# EAGLE design Controls PDB (EAGLE 8.6.0)
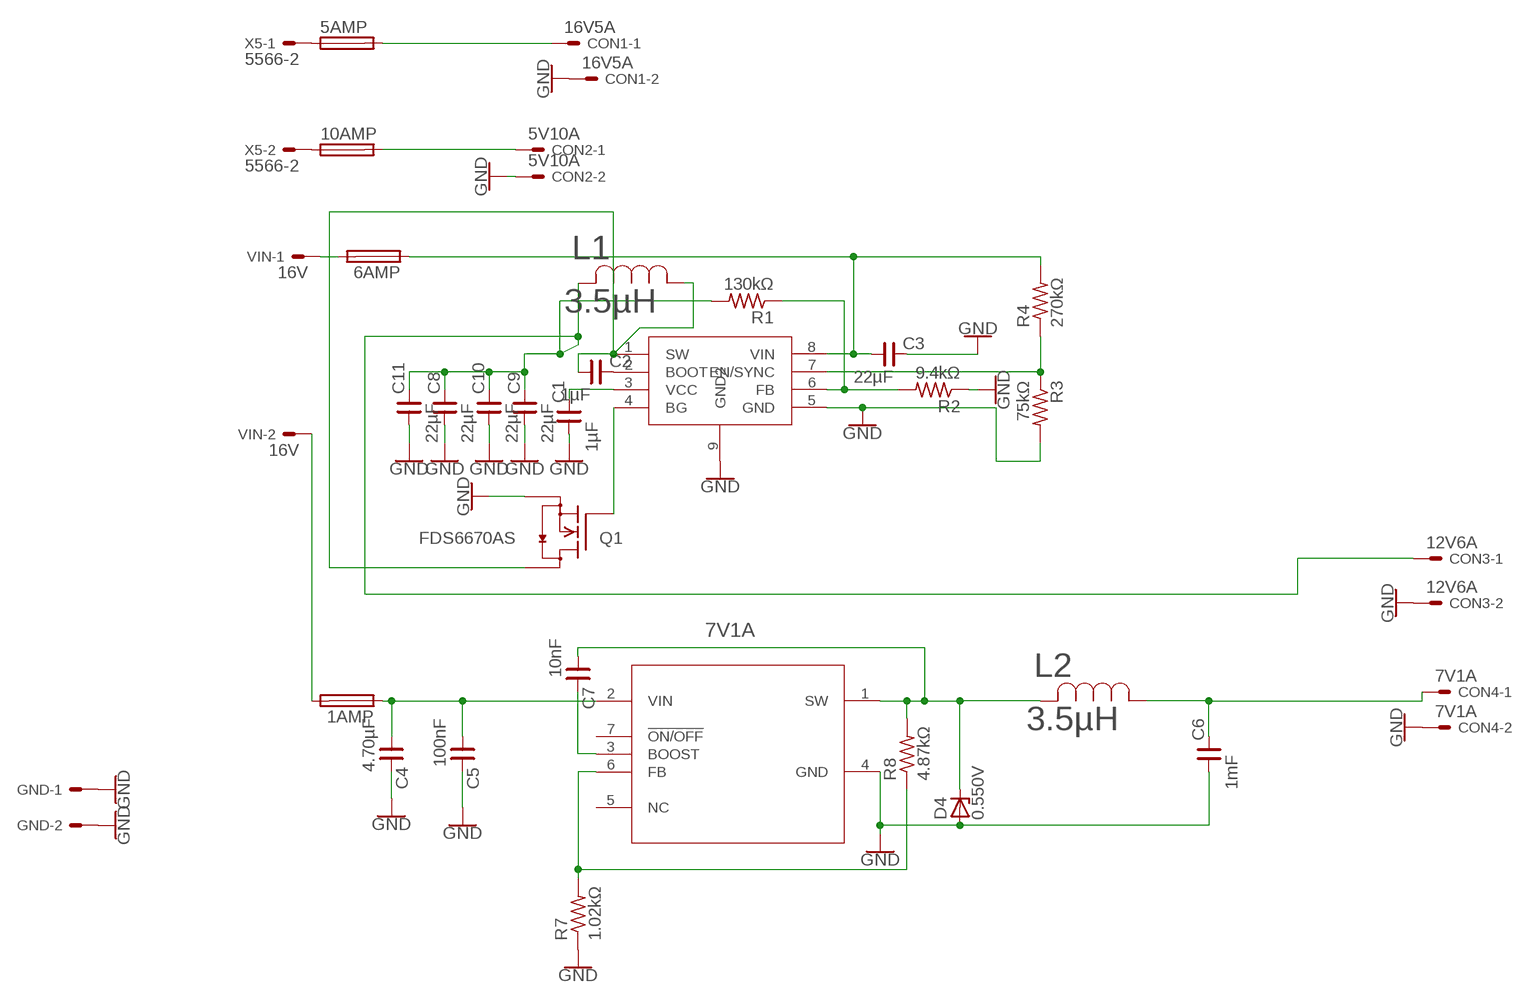
[diagram p0: schematic, sheet 1]

## Parts
1AMP  FUSEBLANK_5X20MM  [FUSE_HOLDER_5X20MM]
5AMP  FUSEBLANK_5X20MM  [FUSE_HOLDER_5X20MM]
6AMP  FUSEBLANK_5X20MM  [FUSE_HOLDER_5X20MM]
7V1A  LM2678T-3.3/NOPB  [TA07B]
10AMP  FUSEBLANK_5X20MM  [FUSE_HOLDER_5X20MM]
C1  1µF  CNP-1206  [1206]
C2  1µF  CNP-1206  [1206]
C3  22µF  CNP-1206  [1206]
C4  4.70µF  CNP-1206  [1206]
C5  100nF  CNP-1206  [1206]
C6  1mF  CNP-1206  [1206]
C7  10nF  CNP-1206  [1206]
C8  22µF  CNP-1206  [1206]
C9  22µF  CNP-1206  [1206]
C10  22µF  CNP-1206  [1206]
C11  22µF  CNP-1206  [1206]
CON1  16V5A  5566-2  [5566-2]
CON2  5V10A  5566-2  [5566-2]
CON3  12V6A  5566-2  [5566-2]
CON4  7V1A  5566-2  [5566-2]
D4  0.550V  SMF5.0A  [SOD123F]
GND  5566-2  [5566-2]
L1  3.5µH  SRR1260-3R5Y  [IND_BOURNS_SRR1260]
L2  3.5µH  SRR1260-3R5Y  [IND_BOURNS_SRR1260]
Q1  FDS6670AS  [SO-8]
R1  130kΩ  R-US_R1206  [R1206]
R2  9.4kΩ  R-US_R1206  [R1206]
R3  75kΩ  R-US_R1206  [R1206]
R4  270kΩ  R-US_R1206  [R1206]
R7  1.02kΩ  R-US_R1206  [R1206]
R8  4.87kΩ  R-US_R1206  [R1206]
U$1  SOIC  [SOIC127P599X175-9N]
VIN  16V  5566-2  [5566-2]
X5  5566-2  [5566-2]

## Nets
GND: 7V1A.4(GND) C1.P$1 C3.P$2 C4.P$2 C5.P$2 C6.P$1 C8.P$1 C9.P$1 C10.P$1 C11.P$1 CON1.2 CON2.2 CON3.2 CON4.2 D4.A GND.1 GND.2 Q1.3(S) R2.1 R3.2 R7.1 U$1.5(GND) U$1.9(GND2)
N$1: C2.P$2 U$1.2(BOOT)
N$4: C1.P$2 U$1.3(VCC)
N$5: R1.1 R2.2 U$1.6(FB)
N$6: 10AMP.2 CON2.1
N$7: 5AMP.2 CON1.1
N$8: 5AMP.1 X5.1
N$9: 10AMP.1 X5.2
N$10: 1AMP.2 VIN.2
N$11: 6AMP.1 C3.P$1 R4.2 U$1.8(VIN)
N$12: R3.1 R4.1 U$1.7(EN/SYNC)
N$13: C6.P$2 CON4.1 L2.1
N$14: 6AMP.2 VIN.1
N$15: Q1.4(G) U$1.4(BG)
N$16: 7V1A.1(SW) C7.P$1 D4.C L2.2 R8.2
N$17: 1AMP.1 7V1A.2(VIN) C4.P$1 C5.P$1
N$18: 7V1A.6(FB) R7.2 R8.1
N$19: 7V1A.3(BOOST) C7.P$2
N$20: C2.P$1 L1.1 Q1.8(D) U$1.1(SW)
N$21: C8.P$2 C9.P$2 C10.P$2 C11.P$2 CON3.1 L1.2 R1.2
Unconnected: 7V1A.5(NC) 7V1A.7(!ON/OFF) Q1.1(S) Q1.2(S) Q1.5(D) Q1.6(D) Q1.7(D)

## Library data of the parts
1AMP 5AMP 6AMP 10AMP = fuse:FUSE: Fuse; OC_FARNELL: unknown; OC_NEWARK: unknown
7V1A = lm2678thruHoleFunctional:LM2678T-3.3/NOPB; MANUFACTURER_PART_NUMBER: LM2678T3.3NOPB; VENDOR: Texas Instruments
C1-C11 = cap-master:CNP-: NON-POLARIZED CAP
CON1-CON4 GND VIN X5 = con-molex:5566-2: Mini FIT connector 2 pol Source: http://www.molex.com; OC_FARNELL: 1822072; OC_NEWARK: unknown
D4 = smf_11:SMF*A: SMF Series TVS Diodes Source: http://www.littelfuse.com/~/media/electronics/datasheets/tvs_diodes/littelfuse_tvs_diode_smf_datasheet.pdf.pdf; MF: Littelfuse; MPN: SMF5.0A; OC_FARNELL: unknown; OC_NEWARK: unknown
L1 L2 = inducteeer:SRR1260-3R5Y; MANUFACTURER_PART_NUMBER: SRR12603R5Y; VENDOR: Bourns Electronics
Q1 = FDS6670AS:FDS6670AS: Fairchild's FDS6670AS 30V N-Channel PowerTrench® SyncFET General Description: The FDS6670AS is designed to replace a single SO-8 MOSFET and Schottky diode in synchronous DC:DC power supplies. This 30V MOSFET is designed to maximize power conversion efficiency, providing a low RDS(ON) and low gate charge. The FDS6670AS includes an integrated Schottky diode using Fairchild's monolithic SyncFET technology. Applications: DC/DC converter Low side notebook Features: 13.5 A, 30 V. RDS(ON) max= 9.0 mOhm @ VGS = 10 V RDS(ON) max= 11.5 mOhm @ VGS = 4.5 V Includes SyncFET Schottky body diode Low gate charge (27nC typical) High performance trench technology for extremely low RDS(ON) and fast switching High power and current handling capability Please send any comments to: messi@users.sourceforge.net; AVAILABILITY: Good; DESCRIPTION: FDS6670AS Series N-Channel 30 V 9 mOhm PowerTrench Mosfet - SOIC-8; MF: ON; MP: FDS6670AS; PACKAGE: SOIC-8 Fairchild Semiconductor; PRICE: 0.47 USD
R1-R4 R7 R8 = resistor:R-US_: RESISTOR, American symbol
U$1 = SOIC127P599X175-9N:SOIC

## Net classes
0 top: width 1.016 mm
1 bottom: width 1.016 mm

## Board
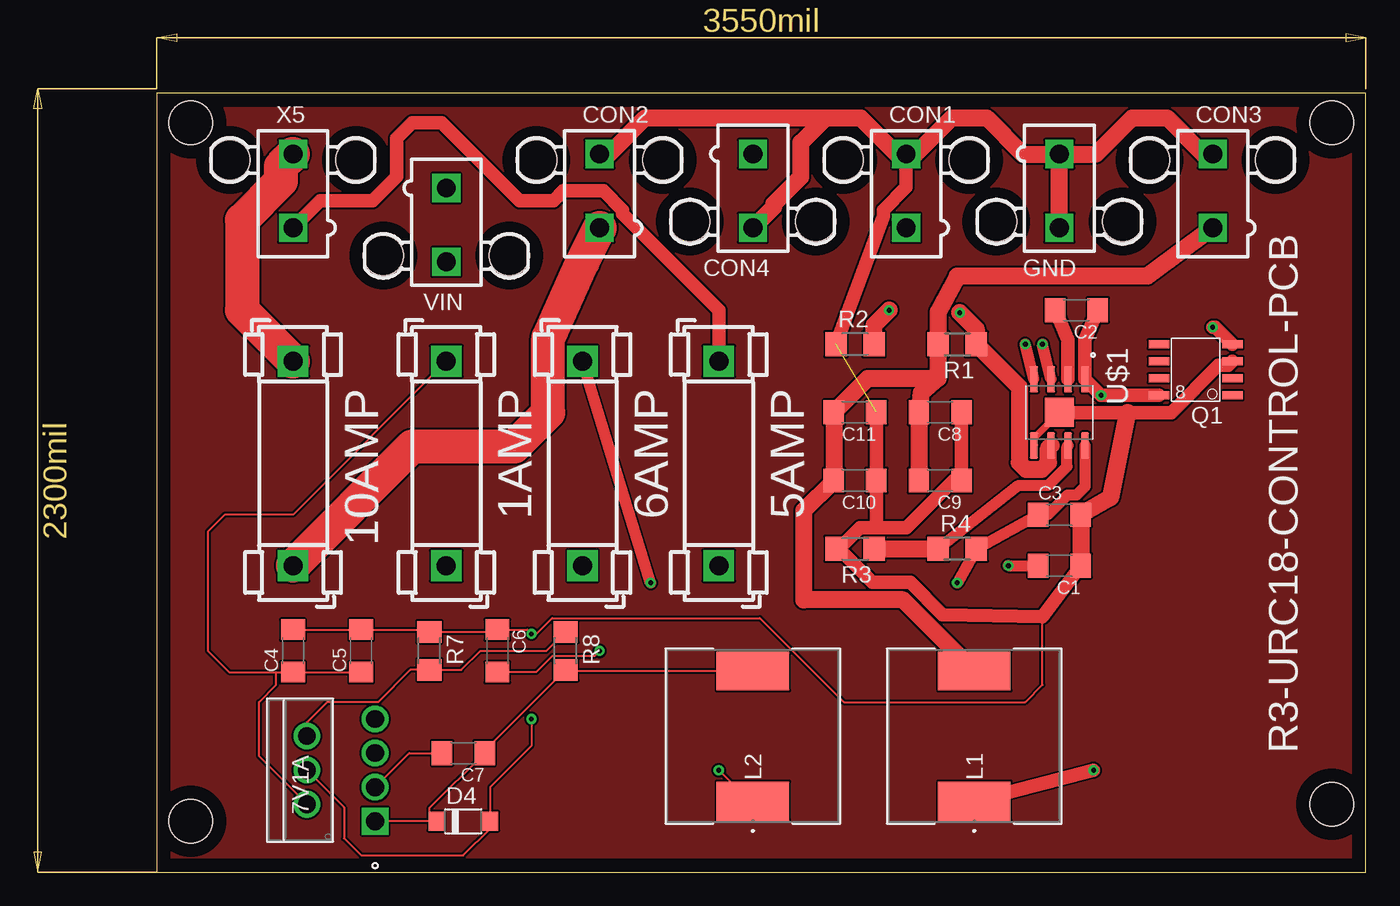
[diagram p1: board, top side]
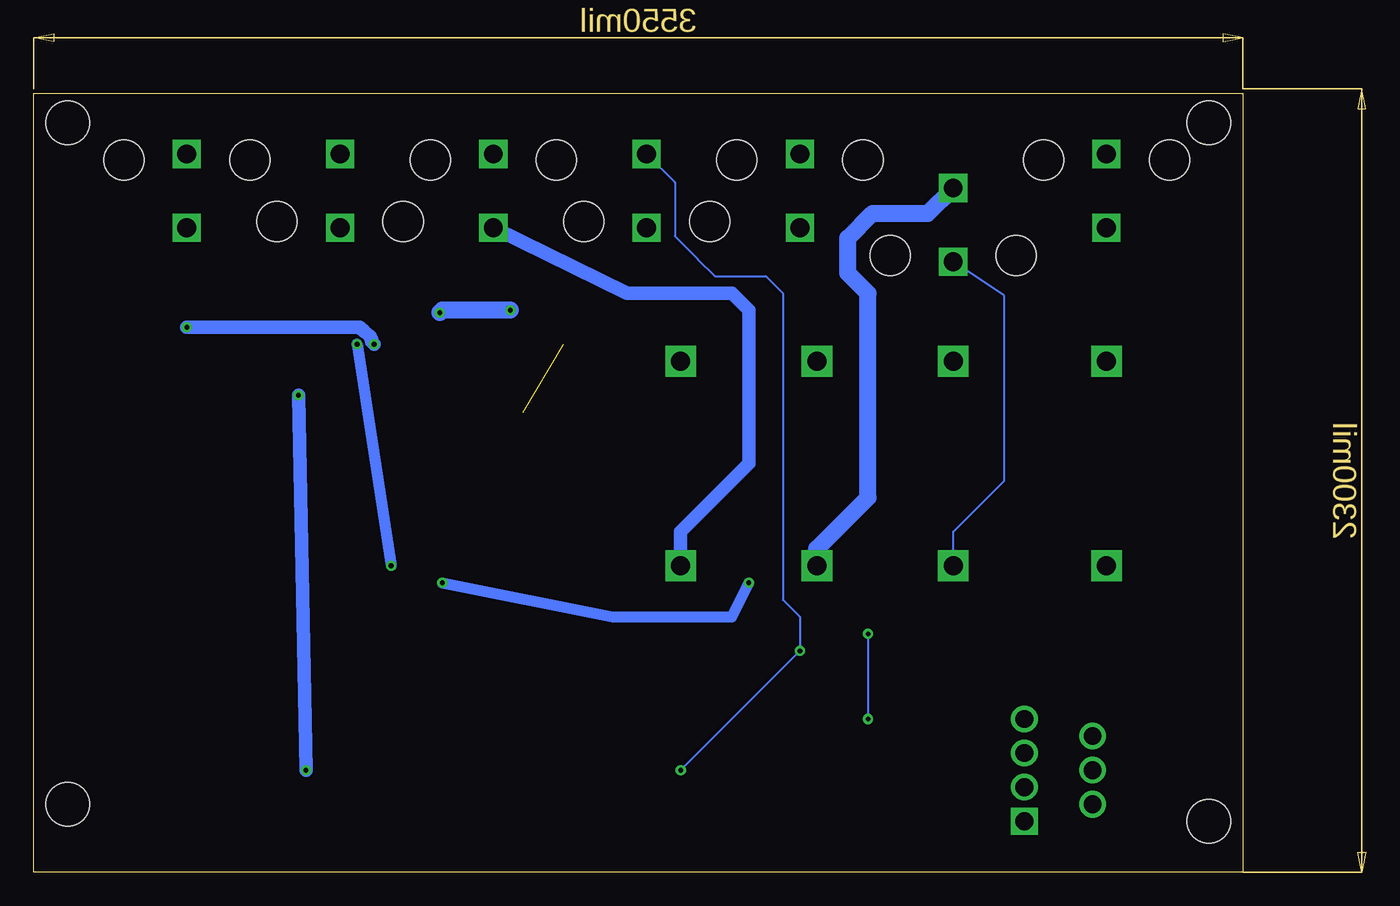
[diagram p2: board, bottom side, seen from below]

Size 90.15 x 58.09 mm. Coordinates in mm from the lower left corner, seen from the top.
Outline: 0,0 90.15,0 90.15,58.09 0,58.09 0,0
Copper layers (1*16): Top 0.035mm / dielectric 1.5mm / Bottom 0.035mm
Design rules "default": minimum track width 6mil, minimum drill 0.35mm, track to track 6mil, track to pad 6mil, pad to pad 6mil, via to via 6mil, smd to smd 6mil, copper to edge 40mil, drill to drill 6mil, minimum pad ring 10mil, minimum via ring 8mil, stop-mask expansion 4mil, vias tented up to drill 0mil, thermal gap 10mil
Holes 3.25 mm at 2.54,55.88 87.63,55.88 87.63,5.08 2.54,3.81

### Footprints (pad centres in the part's own frame; a part is rotated, then mirrored left to right if it is on the bottom)
FUSE_HOLDER_5X20MM = drill 1.422 pad 2.286 square: 1 0,0; 2 15.24,0
TA07B = drill 1.321 pad 1.829 square: 1 -7.62,-11.201 | drill 1.321 pad 1.829: 2 -6.35,-6.121; 3 -5.08,-11.201; 4 -3.81,-6.121; 5 -2.54,-11.201; 6 -1.27,-6.121; 7 0,-11.201
1206 = smd 1.524 x 1.778: P$1 -1.587,0; P$2 1.587,0
5566-2 = drill 1.4 square: 1 0,-2.75; 2 0,2.75 | hole 3: 4.7,2.29; -4.7,2.29
SOD123F = smd 1.2 x 1.4: A 2,0; C -2,0
IND_BOURNS_SRR1260 = smd 2.896 x 5.41: 1 -4.851,0; 2 4.851,0
SO-8 = smd 1.524 x 0.61: 1 -2.743,1.27; 2 -2.743,0; 3 -2.743,-1.27; 4 -2.743,-2.54; 5 2.743,-2.54; 6 2.743,-1.27; 7 2.743,0; 8 2.743,1.27
R1206 = smd 1.6 x 1.803: 1 -1.422,0; 2 1.422,0
SOIC127P599X175-9N = smd 1.97 x 0.6: 1 -2.47,1.905; 2 -2.47,0.635; 3 -2.47,-0.635; 4 -2.47,-1.905; 5 2.47,-1.905; 6 2.47,-0.635; 7 2.47,0.635; 8 2.47,1.905 | smd 2.15 x 2.15: 9 0,0

### Placement (x,y rotation side)
1AMP  21.59,38.1 270 top
5AMP  41.91,38.1 270 top
6AMP  31.75,38.1 270 top
7V1A  5.08,11.43 90 top
10AMP  10.16,38.1 270 top
C1  67.31,22.86 180 top
C2  68.58,41.91 180 top
C3  67.31,26.67 0 top
C4  10.16,16.51 90 top
C5  15.24,16.51 90 top
C6  25.4,16.51 270 top
C7  22.86,8.89 180 top
C8  58.42,34.29 180 top
C9  58.42,29.21 180 top
C10  52.07,29.21 180 top
C11  52.07,34.29 180 top
CON1  55.88,50.8 0 top
CON2  33.02,50.8 0 top
CON3  78.74,50.8 0 top
CON4  44.45,50.8 180 top
D4  22.86,3.81 0 top
GND  67.31,50.8 180 top
L1  60.96,10.16 90 top
L2  44.45,10.16 90 top
Q1  77.47,36.83 180 top
R1  59.69,39.37 180 top
R2  52.07,39.37 0 top
R3  52.07,24.13 180 top
R4  59.69,24.13 0 top
R7  20.32,16.51 270 top
R8  30.48,16.51 270 top
U$1  67.31,34.29 270 top
VIN  21.59,48.26 180 top
X5  10.16,50.8 0 top

### Tracks (layer width: path | path; a pad name or v marks a point on that pad's centre or on a via)
GND  (via drill 0.35)  (1 unrouted)
  Top 0.152: C4.P$2 C5.P$2 20.15,18.1 R7.1 25.23,17.93 C6.P$1 27.62,18.1 v27.94,17.78 28.3,17.78 29.48,18.96 44.98,18.96 51.24,12.7 64.77,12.7 66.04,13.97 66.04,19.05 | 7V1A.4 13.97,4.85 13.97,2.54 15.24,1.27 22.86,1.27 24.86,3.27 D4.A 24.86,6.35 27.94,9.43 v27.94,11.43
  Top 0.508: U$1.5 65.45,31.87 65.45,32.41 67.31,34.27 U$1.9
  Top 1.016: Q1.3 79.91,37.8 79.18,37.8 75.65,34.27 72.39,34.27 67.31,34.27 | C8.P$1 C9.P$1 59.42,29.21 55.9,25.69 53.66,25.69 | 50.86,24.13 52.42,25.69 53.34,25.69 53.66,25.69 | C11.P$1 C10.P$1 53.66,25.69 | R3.2 50.86,24.13 | 50.86,24.13 53.37,21.62 56.19,21.62 58.59,19.22 66.04,19.05 C1.P$1 | R2.1 54.17,48.91 54.17,49.37 55.88,51.08 CON1.2
  Top 1.27: CON2.2 33.72,53.55 36.41,56.24 49.53,56.24 | 49.53,56.24 52.48,56.24 55.18,53.55 CON1.2 56.58,53.55 59.27,56.24 61.88,56.24 64.58,53.55 GND.1 | GND.1 70.04,53.55 72.73,56.24 75.35,56.24 78.04,53.55 CON3.2 | GND.2 GND.1 | CON4.2 46,49.6 46,49.81 48.03,51.84 48.03,54.4 49.53,55.9 49.53,56.24 | 72.39,34.27 71.12,27.94 C3.P$2 C1.P$1
  Bottom 0.152: v27.94,17.78 v27.94,11.43
N$1
  Top 1.016: C2.P$2 67.95,39.69 U$1.2
N$2
  pour Top: 0,58.42 90.17,58.42 90.17,0 0,0
N$4  (via drill 0.35)
  Top 0.813: U$1.3 v66.04,39.37 | v63.5,22.86 C1.P$2
  Bottom 0.813: v66.04,39.37 v63.5,22.86
N$5  (via drill 0.35)
  Top 1.27: R2.2 53.49,40.79 v54.61,41.91 | v59.88,41.72 61.11,40.49 R1.1 64.32,36.16 64.32,30.55 64.82,30.05 65.99,30.05 66.49,30.55 66.49,31.64 U$1.6
  Bottom 1.27: v54.61,41.91 59.69,41.91 v59.88,41.72
N$6
  Top 2.54: 10AMP.2 19.05,31.75 26.67,31.75 29.18,34.27 29.18,39.83 29.21,39.86 31.75,45.51 CON2.1
N$7
  Bottom 1.016: 5AMP.2 41.91,25.4 36.83,30.48 36.83,41.91 38.1,43.18 45.93,43.18 CON1.1
N$8
  Top 1.016: X5.1 12.18,50.07 16.11,50.07 17.88,51.84 17.88,54.71 19.05,55.88 21.25,55.88 27.07,50.07 29.57,50.07 30.31,50.8 33.3,50.8 34.73,49.37 34.73,49.09 41.91,41.91 5AMP.1
N$9
  Top 2.54: X5.2 9.25,52.64 9.25,51.52 6.35,48.63 6.35,41.91 10AMP.1
N$10
  Bottom 0.152: 1AMP.2 21.59,25.4 17.78,29.21 17.78,42.97 VIN.2
N$11  (via drill 0.35)
  Top 0.813: U$1.8 69.22,28.75 68.58,28.12 67.9,28.12 66.46,26.67 C3.P$1 R4.2 v59.69,21.59 | v36.83,21.59 6AMP.1
  Bottom 0.813: v59.69,21.59 46.99,19.05 38.1,19.05 v36.83,21.59
N$12
  Top 0.813: R4.1 64.26,28.85 66.48,28.85 67.87,30.24 67.87,31.74 U$1.7
  Top 1.27: R3.1 R4.1
N$13  (via drill 0.35)
  Top 0.152: C6.P$2 28.29,14.92 29.48,16.12 32.63,16.12 v33.02,16.51 | L2.1 44.22,5.31 v41.91,7.62
  Bottom 0.152: CON4.1 42.34,51.44 42.34,47.44 40.64,45.73 40.64,45.72 39.37,44.45 35.56,44.45 34.29,43.18 34.29,20.32 33.02,19.05 v33.02,16.51 v41.91,7.62
N$14
  Bottom 1.27: 6AMP.2 31.75,24.13 27.94,27.94 27.94,43.16 29.44,44.67 29.44,47.28 27.59,49.12 23.48,49.12 VIN.1
N$15  (via drill 0.35)
  Top 0.813: U$1.4 v64.77,39.37
  Top 1.016: v78.74,40.64 78.94,40.64 Q1.4
  Bottom 1.016: v64.77,39.37 64.95,39.55 64.95,39.75 65.03,39.83 65.05,39.97 65.49,40.29 65.84,40.64 v78.74,40.64
N$16
  Top 0.152: L2.2 30.56,15.01 R8.2 24.45,9.06 C7.P$1 20.32,4.76 20.32,3.81 D4.C 7V1A.1
N$17
  Top 0.152: 1AMP.1 10.16,26.67 5.08,26.67 3.81,25.4 3.81,16.51 5.4,14.92 8.89,14.92 | 8.89,14.92 C4.P$1 C5.P$1 | 8.89,14.92 8.89,13.97 7.62,12.7 7.62,8.66 7V1A.2
N$18
  Top 0.152: 7V1A.6 11.2,11.2 12.7,12.7 16.51,12.7 18.9,15.09 R7.2 22.71,15.09 24.13,16.51 29.06,16.51 R8.1
N$19
  Top 0.152: 7V1A.3 18.82,8.89 C7.P$2
N$20  (via drill 0.35)
  Top 1.016: C2.P$1 69.22,39.69 U$1.1 v70.42,35.56 Q1.8 | L1.1 v69.85,7.62
  Bottom 1.016: v69.85,7.62 v70.42,35.56
N$21
  Top 1.27: CON3.1 73.87,44.45 59.69,44.45 58.27,41.76 R1.2 58.27,36.83 | 58.27,36.83 57,35.73 C8.P$2 C9.P$2 | L1.2 55.65,20.32 48.26,20.32 48.26,26.99 C10.P$2 C11.P$2 53.02,36.83 58.27,36.83

### Text on the board
tNames: R3-URC18-CONTROL-PCB